# EAGLE design Harp Motor device H2-module v1.0 (EAGLE 9.6.2)
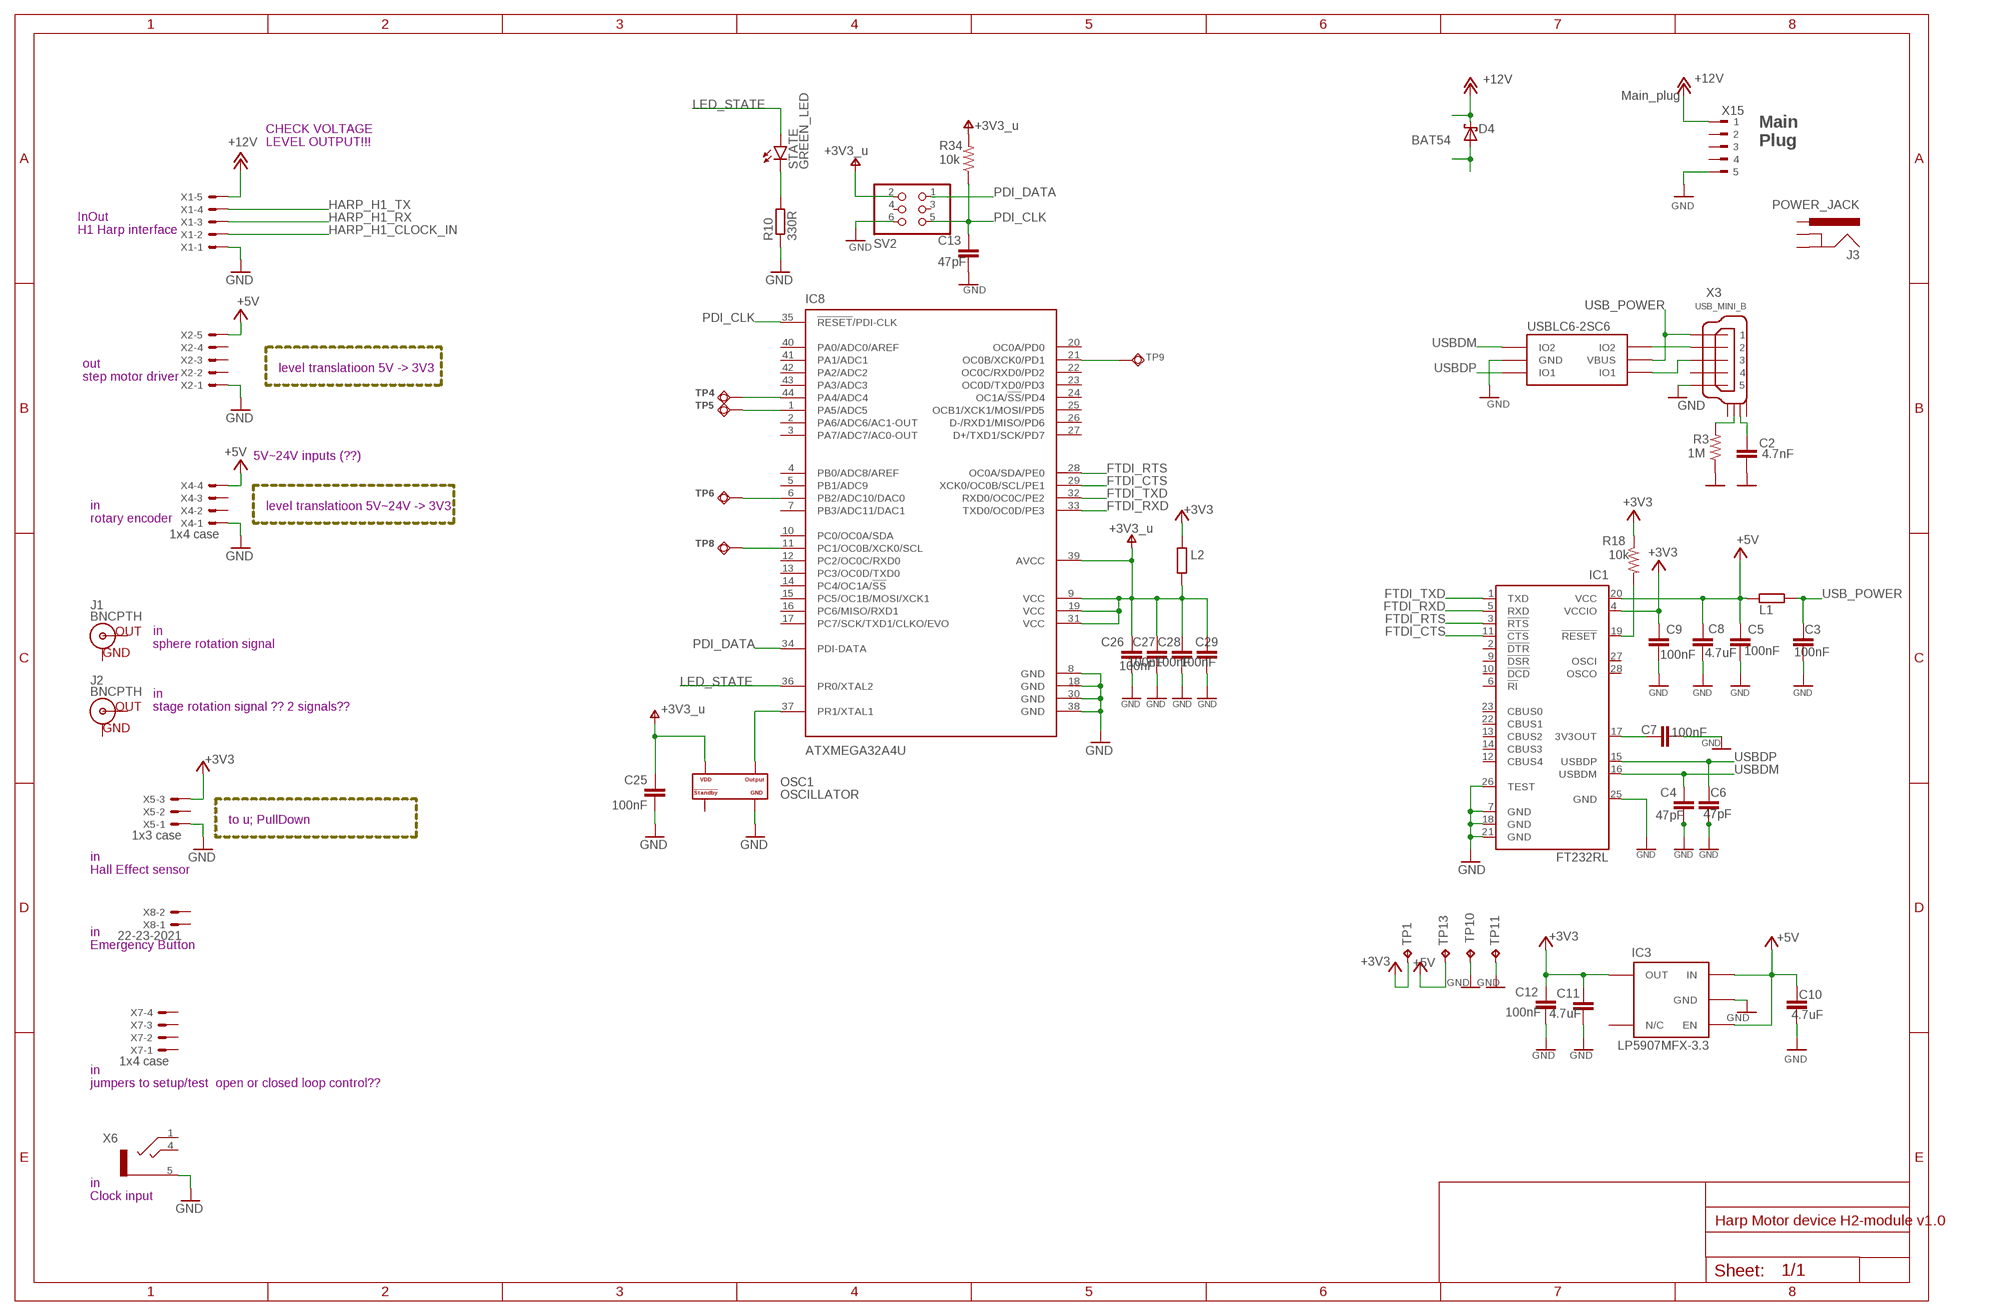
[diagram p0: schematic, sheet 1]

## Parts
C2  4.7nF  C-EUC0402K  [C0402K]
C3  100nF  C-EUC0402K  [C0402K]
C4  47pF  C-EUC0402K  [C0402K]
C5  100nF  C-EUC0402K  [C0402K]
C6  47pF  C-EUC0402K  [C0402K]
C7  100nF  C-EUC0402K  [C0402K]
C8  4.7uF  C-EUC0603  [C0603]
C9  100nF  C-EUC0402K  [C0402K]
C10  4.7uF  C-EUC0603K  [C0603K]
C11  4.7uF  C-EUC0603K  [C0603K]
C12  100nF  C-EUC0402K  [C0402K]
C13  47pF  C-EUC0402K  [C0402K]
C25  100nF  C-EUC0402K  [C0402K]
C26  100nF  C-EUC0402K  [C0402K]
C27  100nF  C-EUC0402K  [C0402K]
C28  100nF  C-EUC0402K  [C0402K]
C29  100nF  C-EUC0402K  [C0402K]
D4  BAT54  [SOT23]
IC1  FT232RL  [SSOP28]
IC3  LP5907MFX-3.3  TLV700XX  [TSOT23-5]
IC7  USBLC6-2SC6  [SOT23-6L]
IC8  ATXMEGA32A4U  XMEGA-A4_AT-XMEGA-XXA4-AUTQFP44  [TQFP44]
J1  BNCPTH  [BNC]
J2  BNCPTH  [BNC]
J3  POWER_JACK  [POWER_JACK_PTH]
L1  40R@100MHz  R-EU_R0603  [R0603]
L2  40R@100MHz  R-EU_R0603  [R0603]
OSC1  OSCILLATOR  [OSCILLATOR_3.2X2.5]
R3  1M  R-US_R0402  [R0402@1]
R10  330R  R-EU_R0402  [R0402]
R18  10k  R-US_R0402  [R0402@1]
R34  10k  R-US_R0402  [R0402@1]
STATE  GREEN_LED  LEDCHIP-LED0603  [CHIP-LED0603]
SV2  PINHD-2X3  [2X03]
TP1  NO_COMPONENT  TPB1,27  [B1,27]
TP4  NO_COMPONENT  TPSQTP11R  [TP11R]
TP5  NO_COMPONENT  TPSQTP11R  [TP11R]
TP6  NO_COMPONENT  TPSQTP11R  [TP11R]
TP8  NO_COMPONENT  TPSQTP11R  [TP11R]
TP9  NO_COMPONENT  TPSQTP11R  [TP11R]
TP10  NO_COMPONENT  TPB1,27  [B1,27]
TP11  NO_COMPONENT  TPB1,27  [B1,27]
TP13  NO_COMPONENT  TPB1,27  [B1,27]
X1  22-23-2051  [22-23-2051]
X2  22-23-2051  [22-23-2051]
X3  USB_MINI_B  [240-0002-1]
X4  1x4 case  22-23-2041  [22-23-2041]
X5  1x3 case  22-23-2031  [22-23-2031]
X6  CLCK_JACK  STEREO_JACK  [35RASMT2BHNTRX]
X7  1x4 case  22-23-2041  [22-23-2041]
X8  22-23-2021  [22-23-2021]
X15  Main_plug  90G-5  [90G-5]

## Nets
+3V3: C9.1 C11.1 C12.1 IC1.4(VCCIO) IC3.5(OUT) L2.2 R18.1 TP1.TP X5.3
+3V3_U: C25.1 C26.1 C27.1 C28.1 C29.1 IC8.9(VCC) IC8.19(VCC) IC8.31(VCC) IC8.39(AVCC) L2.1 OSC1.P$4(VDD) R34.2 SV2.2 ; supply symbol labelled +3V3_u
+5V: C5.1 C8.1 C10.1 IC1.20(VCC) IC3.1(IN) IC3.3(EN) L1.1 TP13.TP
+12V: D4.3(C) X15.1
FTDI_CTS: IC1.11(!CTS) IC8.29(XCK0/OC0B/SCL/PE1)
FTDI_RTS: IC1.3(!RTS) IC8.28(OC0A/SDA/PE0)
FTDI_RXD: IC1.5(RXD) IC8.33(TXD0/OC0D/PE3)
FTDI_TXD: IC1.1(TXD) IC8.32(RXD0/OC0C/PE2)
GND: C2.2 C3.2 C4.2 C5.2 C6.2 C7.2 C8.2 C9.2 C10.2 C11.2 C12.2 C13.2 C25.2 C26.2 C27.2 C28.2 C29.2 IC1.7(GND) IC1.18(GND) IC1.21(GND) IC1.25(GND) IC1.26(TEST) IC3.2(GND) IC7.P$2(GND) IC8.8(GND) IC8.18(GND) IC8.30(GND) IC8.38(GND) OSC1.P$2(GND) R3.1 R10.1 SV2.6 TP10.TP TP11.TP X1.1 X2.1 X3.P$5 X4.1 X5.1 X6.5 X15.5
HARP_H1_CLOCK_IN: X1.2
HARP_H1_RX: X1.3
HARP_H1_TX: X1.4
LED_STATE: IC8.36(PR0/XTAL2) STATE.A
N$1: R3.2 X3.SHIELD_2
N$2: IC7.P$4(IO2) X3.P$2
N$3: IC7.P$6(IO1) X3.P$3
N$4: X1.5 X2.5 X4.4 ; supply symbol labelled +5V, +12V
N$6: D4.1(A)
N$9: R10.2 STATE.C
N$11: IC8.44(PA4/ADC4) TP4.TP
N$12: IC8.1(PA5/ADC5) TP5.TP
N$13: IC8.6(PB2/ADC10/DAC0) TP6.TP
N$15: C2.1 X3.SHIELD_3
N$17: IC8.11(PC1/OC0B/XCK0/SCL) TP8.TP
N$18: IC8.21(OC0B/XCK0/PD1) TP9.TP
N$38: C7.1 IC1.17(3V3OUT)
N$175: IC1.19(!RESET) R18.2
OSC2: IC8.37(PR1/XTAL1) OSC1.P$3(OUTPUT)
PDI_CLK: C13.1 IC8.35(!RESET!/PDI-CLK) R34.1 SV2.5
PDI_DATA: IC8.34(PDI-DATA) SV2.1
USB_POWER: C3.1 IC7.P$5(VBUS) L1.2 X3.P$1
USBDM: C4.1 IC1.16(USBDM) IC7.P$3(IO2)
USBDP: C6.1 IC1.15(USBDP) IC7.P$1(IO1)
Unconnected: IC1.2(!DTR) IC1.6(!RI) IC1.9(!DSR) IC1.10(!DCD) IC1.12(CBUS4) IC1.13(CBUS2) IC1.14(CBUS3) IC1.22(CBUS1) IC1.23(CBUS0) IC1.27(OSCI) IC1.28(OSCO) IC3.4(N/C) IC8.2(PA6/ADC6/AC1-OUT) IC8.3(PA7/ADC7/AC0-OUT) IC8.4(PB0/ADC8/AREF) IC8.5(PB1/ADC9) IC8.7(PB3/ADC11/DAC1) IC8.10(PC0/OC0A/SDA) IC8.12(PC2/OC0C/RXD0) IC8.13(PC3/OC0D/TXD0) IC8.14(PC4/OC1A/!SS) IC8.15(PC5/OC1B/MOSI/XCK1) IC8.16(PC6/MISO/RXD1) IC8.17(PC7/SCK/TXD1/CLKO/EVO) IC8.20(OC0A/PD0) IC8.22(OC0C/RXD0/PD2) IC8.23(OC0D/TXD0/PD3) IC8.24(OC1A/!SS!/PD4) IC8.25(OCB1/XCK1/MOSI/PD5) IC8.26(D-/RXD1/MISO/PD6) IC8.27(D+/TXD1/SCK/PD7) IC8.40(PA0/ADC0/AREF) IC8.41(PA1/ADC1) IC8.42(PA2/ADC2) IC8.43(PA3/ADC3) J1.GND J1.S(OUT) J2.GND J2.S(OUT) J3.GND J3.GNDBREAK J3.PWR OSC1.P$1(STANDBY#) SV2.3 SV2.4 X2.2 X2.3 X2.4 X3.P$4 X3.SHIELD_1 X3.SHIELD_4 X4.2 X4.3 X5.2 X6.1 X6.4 X7.1 X7.2 X7.3 X7.4 X8.1 X8.2 X15.2 X15.3 X15.4

## Notes on the sheet
- CHECK VOLTAGE 
  LEVEL OUTPUT!!!
- Main 
  Plug
- InOut
  H1 Harp interface
- level translatioon 5V -> 3V3
- out
  step motor driver
- 5V~24V inputs (??)
- level translatioon 5V~24V -> 3V3
- in
  rotary encoder
- in
  sphere rotation signal
- in
  stage rotation signal ?? 2 signals??
- to u; PullDown
- in
  Hall Effect sensor
- in
  Emergency Button
- in
  jumpers to setup/test  open or closed loop control??
- in
  Clock input

## Library data of the parts
C2 = rcl:C-EU: CAPACITOR, European symbol; MPN: CC0402KRX7R8BB472; OEPS: OEPS010001
C3 C5 C7 C9 C12 C25-C29 = rcl:C-EU: CAPACITOR, European symbol; DIGIKEY_PN: 445-5932-1-ND; MPN: C1005X7R1H104K050BB; NOTES: -; OEPS: OEPS010004; TYPE: SMD
C4 C6 C13 = rcl:C-EU: CAPACITOR, European symbol; MPN: 04025A470JAT2A; OEPS: OEPS080013
C8 = rcl:C-EU: CAPACITOR, European symbol; MPN: C1608X6S1C475K080AC; OEPS: OEPS010018
C10 C11 = rcl:C-EU: CAPACITOR, European symbol; MPN: C1608X6S1C475K080AC; NOTES: -; OEPS: OEPS010018; TYPE: SMD
D4 = diode:BAT54: Schottky Diodes Source: Fairchild .. BAT54.pdf; MPN: BAT54SLT1G; OEPS: OEPS030003
IC1 = VestibularVR H1-module v1.0:FT232R: UART/FIFO IC; MPN: FT232RL; OEPS: OEPS080013
IC3 = VestibularVR H1-module v1.0:TLV700XX: C REG LINEAR 3.3V 200MA SOT23-5; MPN: LP5907MFX-3.3/NOPB; NOTES: -; OEPS: OEPS080016; TYPE: SMD
IC7 = VestibularVR H1-module v1.0:USBLC6-2SC6: TVS DIODE 5.25VWM 17VC SOT23-6; MPN: USBLC6-2SC6; OEPS: OEPS030010
IC8 = VestibularVR H1-module v1.0:XMEGA-A4_AT-XMEGA-XXA4-AU: ATxMega a4 Serie; DIGIKEY_PN: ATXMEGA32A4U-AURCT-ND; MOUSER_PN: 556-ATXMEGA32A4U-AU; MPN: ATXMEGA32A4U-AUR; OEPS: OEPS080012
J1 J2 = SparkFun-Connectors:BNC: BNC Right Angle Connector Mouser Part# 5227161 SparkFun Products: BNC Connector - Right Angle <https://www.sparkfun.com/products/10550>; PROD_ID: LPA-12729; SF_ID: PRT-10550
J3 = SparkFun-Connectors:POWER_JACK: Power Jack Connector This is the standard 5.5mm barrel jack for power. The PTH is the most common, proven, reliable, footprint. The Slot footprint only works if the mill layer is transmitted to the PCB fab house so be warned. Here are the connectors we sell at SparkFun: DC Barrel Power Jack/Connector <https://www.sparkfun.com/products/119> (PRT-00119) DC Barrel Power Jack/Connector (SMD) <https://www.sparkfun.com/products/12748> (PRT-12748) DC Barrel Jack Adapter - Breadboard Compatible <https://www.sparkfun.com/products/10811> (PRT-10811) It is used on this SparkFun product (and many, many others): SparkFun RedBoard - Programmed with Arduino <https://www.sparkfun.com/products/12757> (DEV-12757) Also, if you need a mating power supply or connector, please check these out: Wall Adapter Power Supply - 9VDC 650mA <https://www.sparkfun.com/products/298> (TOL-00298) DC Barrel Jack Adapter - Male <https://www.sparkfun.com/products/10287> (PRT-10287); PROD_ID: CONN-08197
L1 L2 = rcl:R-EU_: RESISTOR, European symbol; MPN: MI0805K400R-10; OEPS: OEPS040003; SPICEPREFIX: R
OSC1 = VestibularVR H1-module v1.0:OSCILLATOR: XTAL OSC TCXO 32.0000MHZ HCMOS; MPN: DSC1001CI5-032.0000; OEPS: OEPS080018
R3 = rcl:R-US_: RESISTOR, American symbol; DIGIKEY_PN: 541-1.00MLCT-ND; MPN: CRCW04021M00FKED; OEPS: OEPS020026
R10 = rcl:R-EU_: RESISTOR, European symbol; MPN: RC0402FR-07330RL; OEPS: OEPS020037; SPICEPREFIX: R
R18 R34 = rcl:R-US_: RESISTOR, American symbol; DIGIKEY_PN: 541-3959-1-ND; MPN: CRCW040210K0FKED; OEPS: OEPS020030
STATE = led:LED: LED OSRAM: - CHIPLED LG R971, LG N971, LY N971, LG Q971, LY Q971, LO R971, LY R971 LH N974, LH R974 LS Q976, LO Q976, LY Q976 LO Q996 - Hyper CHIPLED LW Q18S LB Q993, LB Q99A, LB R99A - SideLED LS A670, LO A670, LY A670, LG A670, LP A670 LB A673, LV A673, LT A673, LW A673 LH A674 LY A675 LS A676, LA A676, LO A676, LY A676, LW A676 LS A679, LY A679, LG A679 - Hyper Micro SIDELED® LS Y876, LA Y876, LO Y876, LY Y876 LT Y87S - SmartLED LW L88C, LW L88S LB L89C, LB L89S, LG L890 LS L89K, LO L89K, LY L89K LS L896, LA L896, LO L896, LY L896 - TOPLED LS T670, LO T670, LY T670, LG T670, LP T670 LSG T670, LSP T670, LSY T670, LOP T670, LYG T670 LG T671, LOG T671, LSG T671 LB T673, LV T673, LT T673, LW T673 LH T674 LS T676, LA T676, LO T676, LY T676, LB T676, LH T676, LSB T676, LW T676 LB T67C, LV T67C, LT T67C, LS T67K, LO T67K, LY T67K, LW E67C LS E67B, LA E67B, LO E67B, LY E67B, LB E67C, LV E67C, LT E67C LW T67C LS T679, LY T679, LG T679 LS T770, LO T770, LY T770, LG T770, LP T770 LB T773, LV T773, LT T773, LW T773 LH T774 LS E675, LA E675, LY E675, LS T675 LS T776, LA T776, LO T776, LY T776, LB T776 LHGB T686 LT T68C, LB T68C - Hyper Mini TOPLED® LB M676 - Mini TOPLED Santana® LG M470 LS M47K, LO M47K, LY M47K Source: http://www.osram.convergy.de LUXEON: - LUMILED® LXK2-PW12-R00, LXK2-PW12-S00, LXK2-PW14-U00, LXK2-PW14-V00 LXK2-PM12-R00, LXK2-PM12-S00, LXK2-PM14-U00 LXK2-PE12-Q00, LXK2-PE12-R00, LXK2-PE12-S00, LXK2-PE14-T00, LXK2-PE14-U00 LXK2-PB12-K00, LXK2-PB12-L00, LXK2-PB12-M00, LXK2-PB14-N00, LXK2-PB14-P00, LXK2-PB14-Q00 LXK2-PR12-L00, LXK2-PR12-M00, LXK2-PR14-Q00, LXK2-PR14-R00 LXK2-PD12-Q00, LXK2-PD12-R00, LXK2-PD12-S00 LXK2-PH12-R00, LXK2-PH12-S00 LXK2-PL12-P00, LXK2-PL12-Q00, LXK2-PL12-R00 Source: www.luxeon.com KINGBRIGHT: KA-3528ASYC Source: www.kingbright.com; MPN: LTST-C191KGKT; OEPS: OEPS030005
SV2 = Connector:PINHD-2X3: PIN HEADER; CATEGORY: CONNECTOR; MPN: 609-3210-ND; OEPS: OEPS070015; SUB-CATEGORY: PIN-HEADER
TP1 TP10 TP11 TP13 = testpad:TP: Test pad
TP4-TP6 TP8 TP9 = testpad:TPSQ: Test pad
X1 X2 = con-molex:22-23-2051: .100" (2.54mm) Center Header - 5 Pin; MF: MOLEX; MPN: 22-23-2051; OC_FARNELL: 1462952; OC_NEWARK: 38C9178
X3 = VestibularVR H1-module v1.0:USB_MINI_B: CONN RCPT USB2.0 MINI B SMD R/A; MPN: UX60-MB-5S8; OEPS: OEPS070021
X4 X7 = con-molex:22-23-2041: .100" (2.54mm) Center Header - 4 Pin; MF: -; MPN: 282834-4 Digikey A98335-ND; OC_FARNELL: 1462920; OC_NEWARK: 38C0355; OEPS: OEPS07 xxx1
X5 = con-molex:22-23-2031: .100" (2.54mm) Center Header - 3 Pin; MF: -; MPN: 282834-3 Digikey A98334-ND; OC_FARNELL: 1462950; OC_NEWARK: 30C0862; OEPS: OEPS07 xxx2
X6 = harp input expander:STEREO_JACK: CONN JACK STEREO 3.5MM SMD R/A; MPN: 35RASMT2BHNTRX; NOTES: -; TYPE: SMD
X8 = con-molex:22-23-2021: .100" (2.54mm) Center Header - 2 Pin; MF: MOLEX; MPN: 22-23-2021; OC_FARNELL: 1462926; OC_NEWARK: 25C3832
X15 = con-weidmueller-sl35:90G-5: WEIDMUELLER CLAMP CONNECTOR; MPN: 20.155MH/5-E; OC_FARNELL: unknown; OC_NEWARK: unknown; OEPS: OEPS07 xxx3

## Net classes
0 default: clearance 0.205 mm

## Board
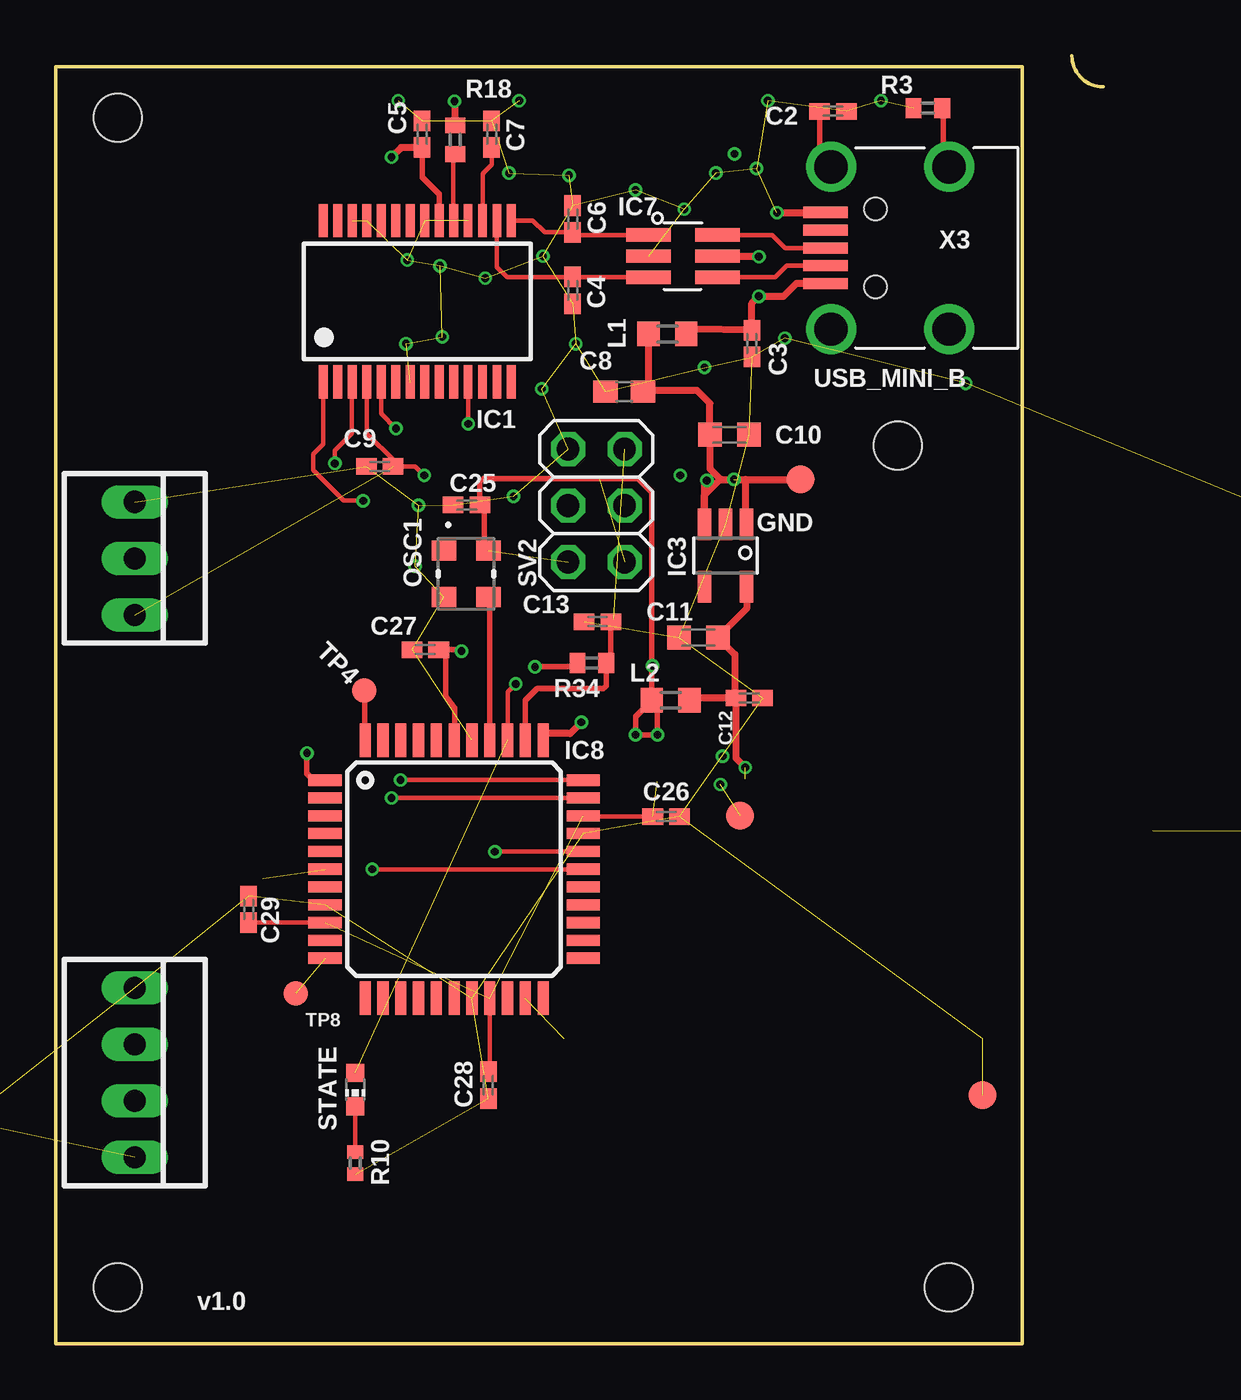
[diagram p1: board, top side]
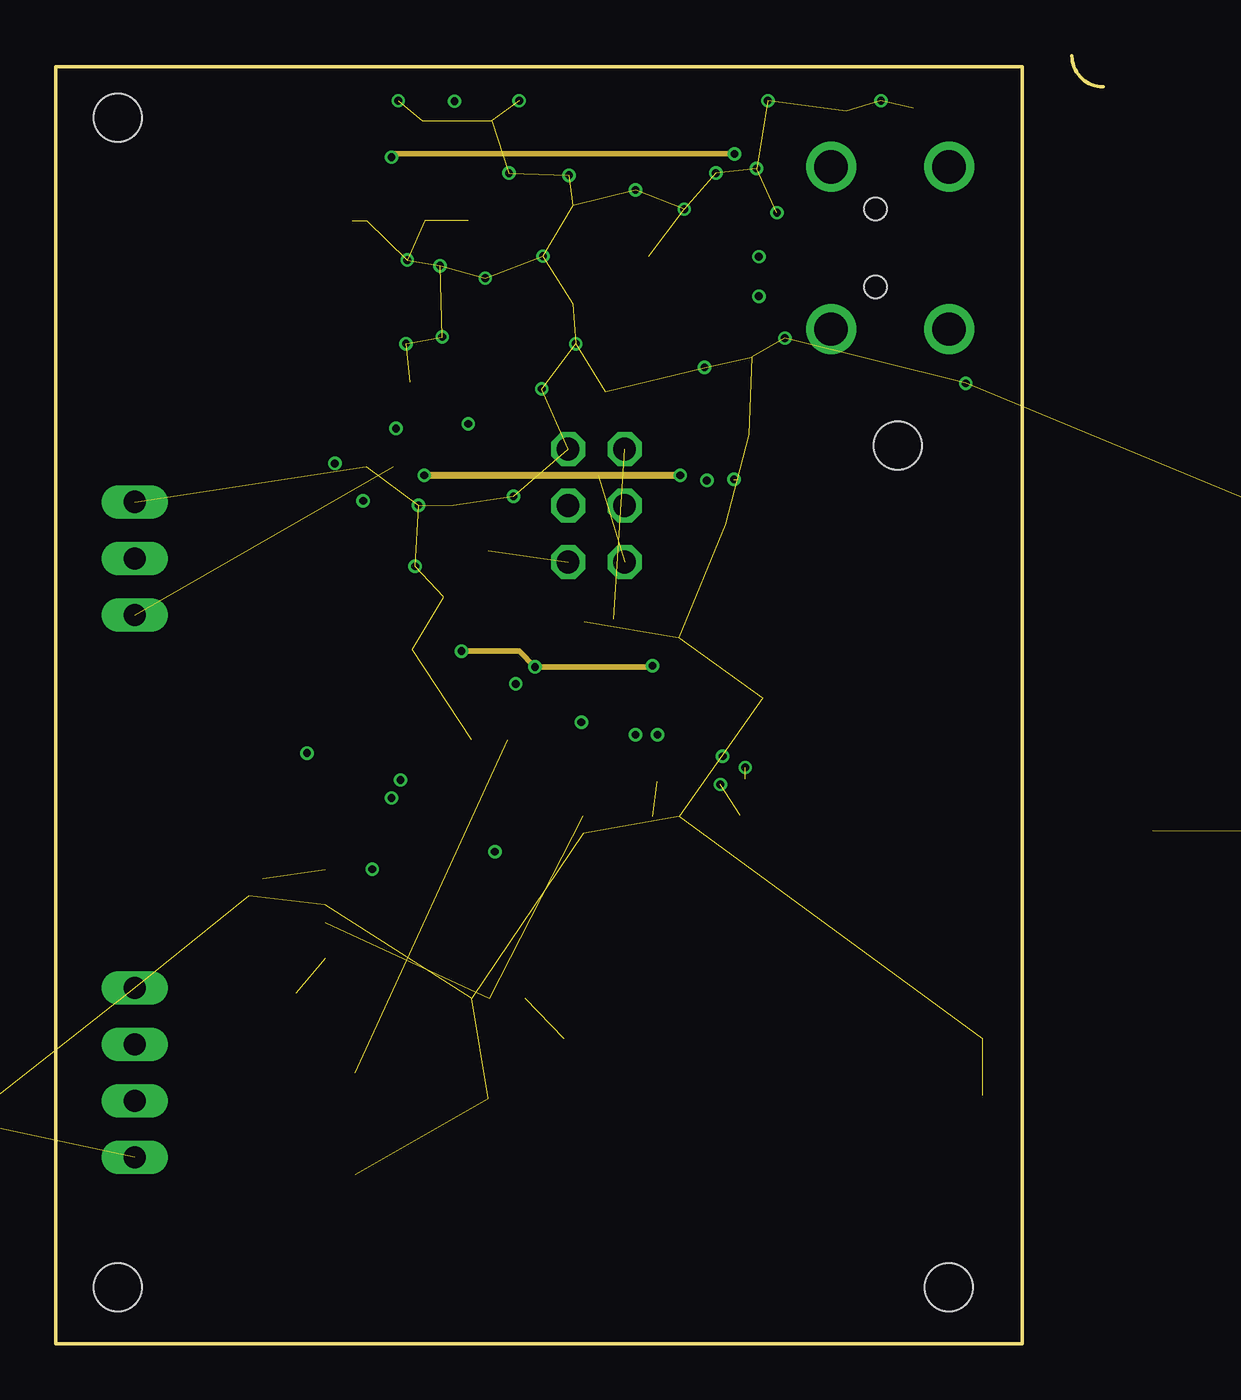
[diagram p2: board, inner layer Route2]
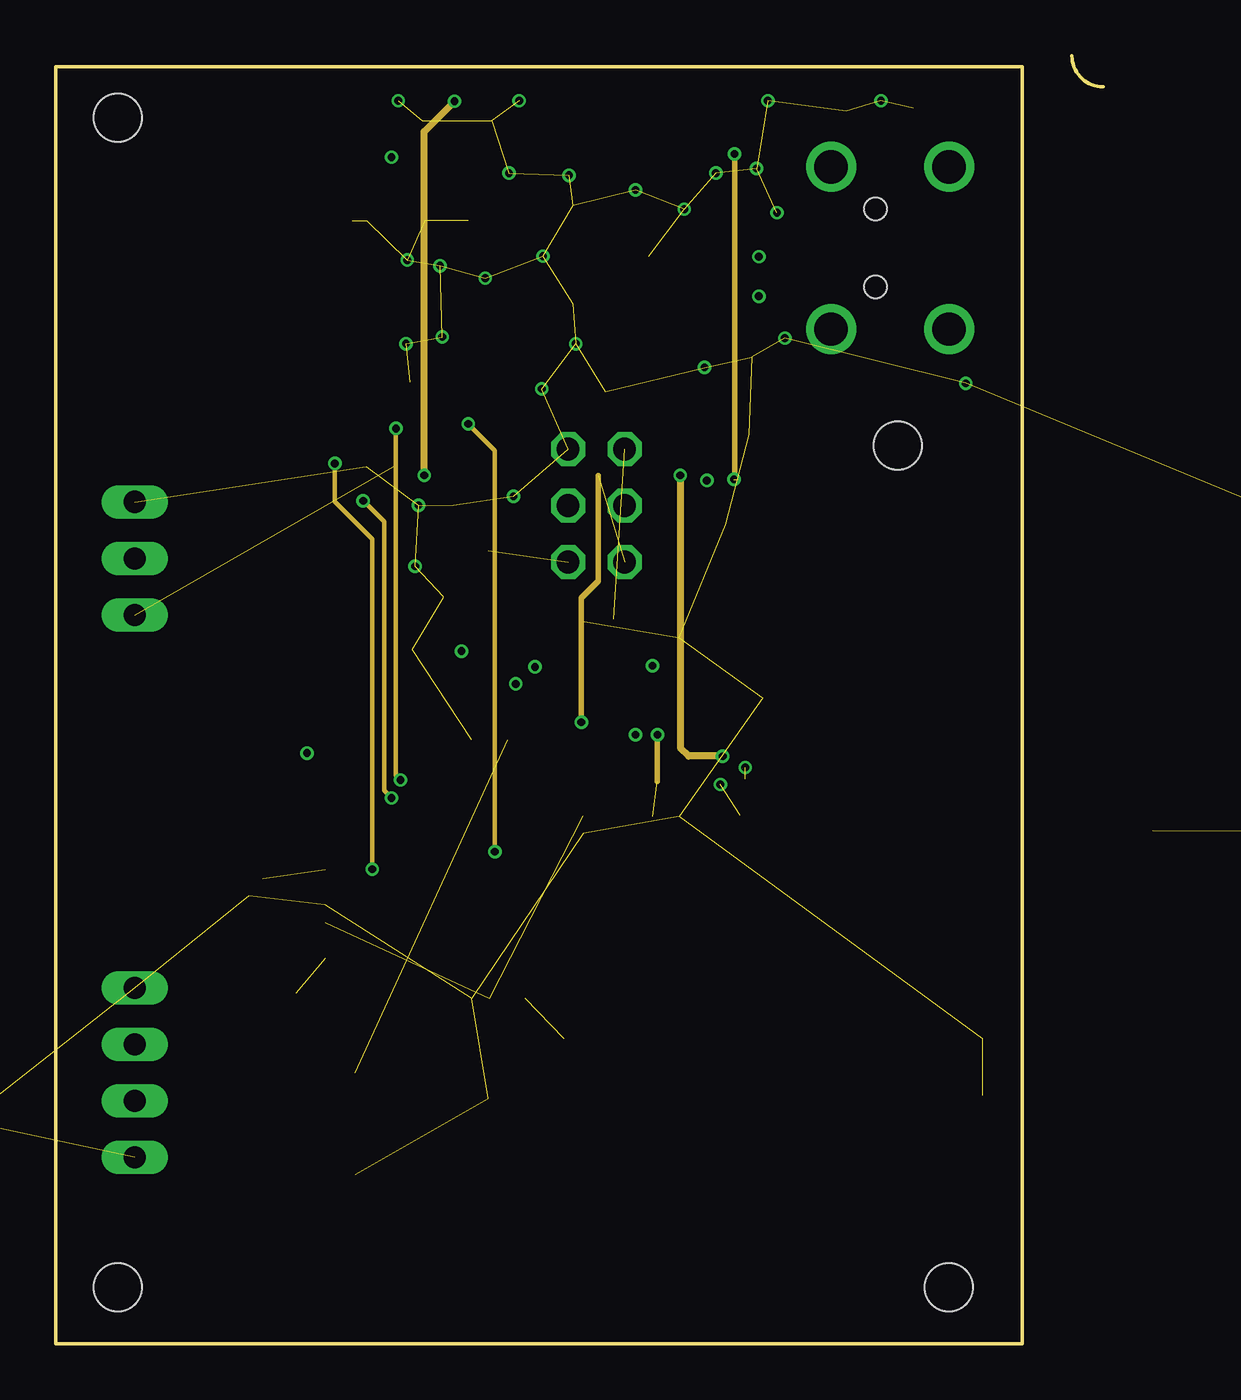
[diagram p3: board, inner layer Route15]
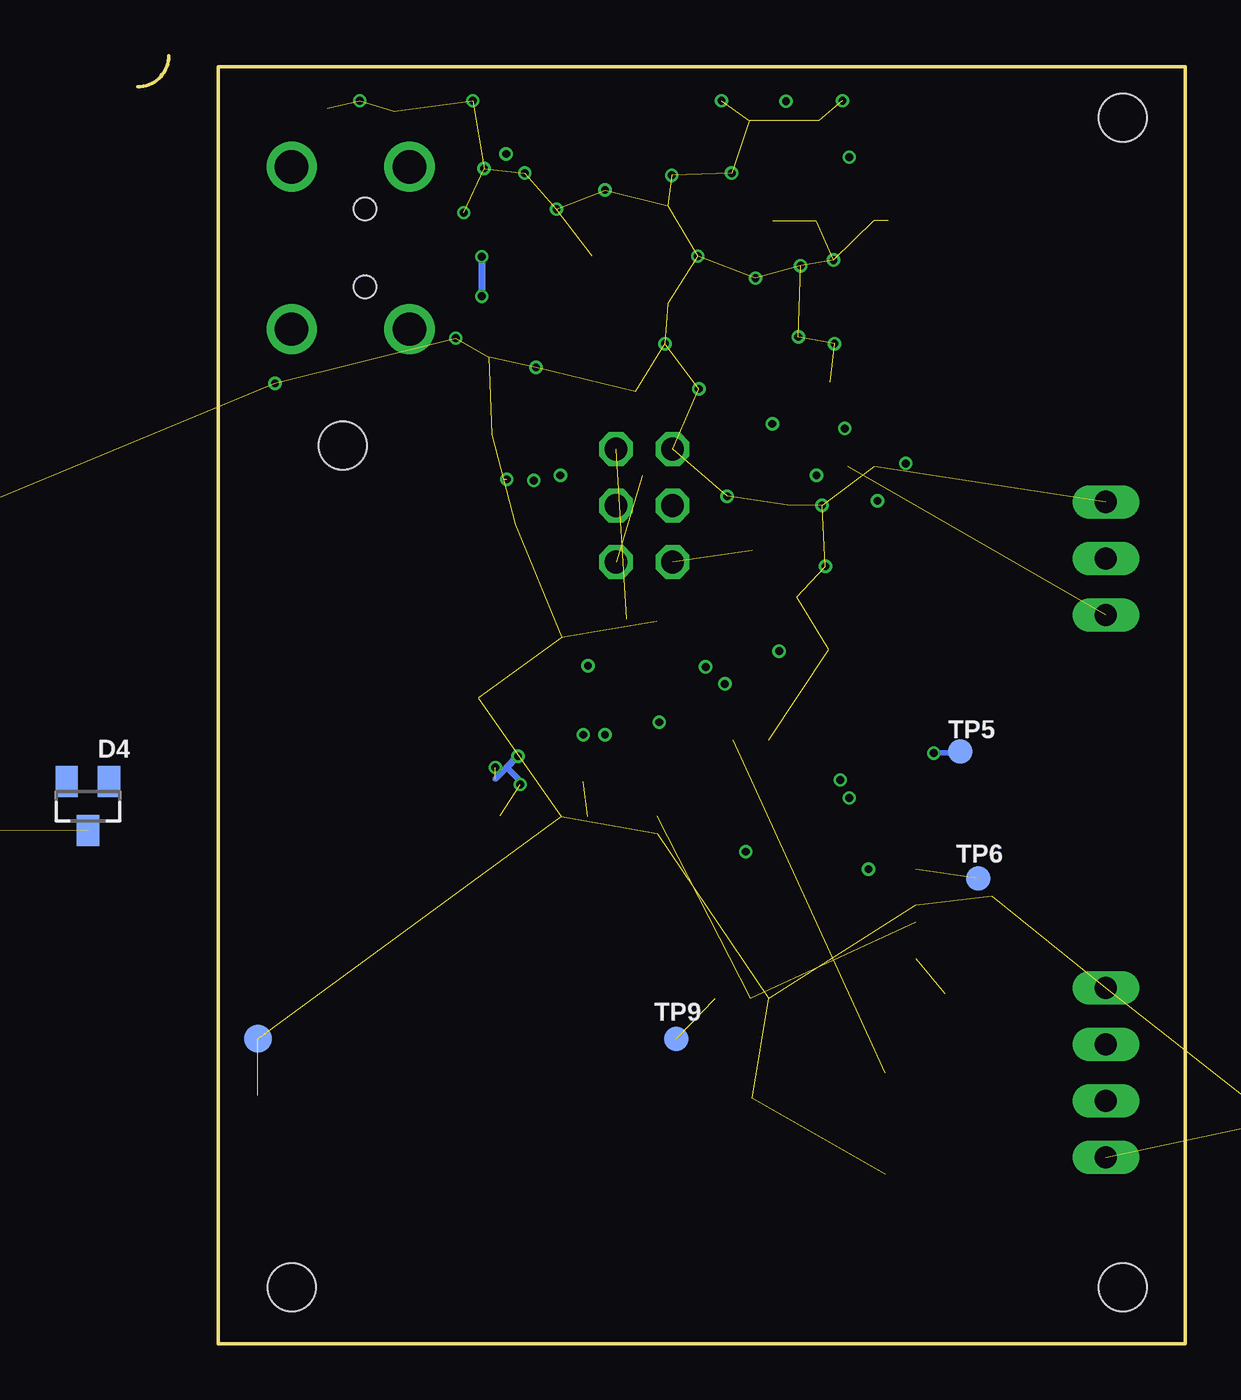
[diagram p4: board, bottom side, seen from below]

Size 47.06 x 57.91 mm. Coordinates in mm from the lower left corner, seen from the top.
Outline: 47.06,56.51 arc-90 45.66,57.91
Outline: 43.43,57.4 0,57.4 0,0 43.43,0 43.43,57.4
Copper layers (1+2*15+16): Top 0.018mm / dielectric 0.36mm / Route2 0.035mm / dielectric 0.71mm / Route15 0.035mm / dielectric 0.2mm / Bottom 0.018mm
Design rules "my design rules": minimum track width 0.15mm, minimum drill 0.35mm, track to track 6mil, track to pad 6mil, pad to pad 6mil, via to via 6mil, smd to smd 6mil, copper to edge 0.25mm, drill to drill 0.35mm, minimum pad ring 0.175mm, minimum via ring 0.125mm, stop-mask expansion 0mil, vias tented up to drill 0.45mm, thermal gap 0.2mm
Holes 2.15 mm at 2.79,2.54 2.79,55.12 40.13,2.54 37.85,40.39

### Footprints (pad centres in the part's own frame; a part is rotated, then mirrored left to right if it is on the bottom)
C0402K = smd 0.925 x 0.74: 1 -0.6,0; 2 0.6,0
C0603 = smd 1.1 x 1: 1 -0.85,0; 2 0.85,0
C0603K = smd 1.05 x 1.08: 1 -0.875,0; 2 0.875,0
SOT23 = smd 1 x 1.4: 1 -0.95,-1.1; 2 0.95,-1.1; 3 0,1.1
SSOP28 = smd 0.4 x 1.5: 1 -4.225,-3.625; 2 -3.575,-3.625; 3 -2.925,-3.625; 4 -2.275,-3.625; 5 -1.625,-3.625; 6 -0.975,-3.625; 7 -0.325,-3.625; 8 0.325,-3.625; 9 0.975,-3.625; 10 1.625,-3.625; 11 2.275,-3.625; 12 2.925,-3.625; 13 3.575,-3.625; 14 4.225,-3.625; 15 4.225,3.625; 16 3.575,3.625; 17 2.925,3.625; 18 2.275,3.625; 19 1.625,3.625; 20 0.975,3.625; 21 0.325,3.625; 22 -0.325,3.625; 23 -0.975,3.625; 24 -1.625,3.625; 25 -2.275,3.625; 26 -2.925,3.625; 27 -3.575,3.625; 28 -4.225,3.625
TSOT23-5 = smd 0.6 x 1.408: 1 -0.95,-1.404; 2 0,-1.404; 3 0.95,-1.404; 4 0.95,1.404; 5 -0.95,1.404
SOT23-6L = smd 0.6 x 2: P$1 -0.95,-1.55; P$2 0,-1.55; P$3 0.95,-1.55; P$4 0.95,1.55; P$5 0,1.55; P$6 -0.95,1.55
TQFP44 = smd 1.5 x 0.5: 1 -5.8,4; 2 -5.8,3.2; 3 -5.8,2.4; 4 -5.8,1.6; 5 -5.8,0.8; 6 -5.8,0; 7 -5.8,-0.8; 8 -5.8,-1.6; 9 -5.8,-2.4; 10 -5.8,-3.2; 11 -5.8,-4; 23 5.8,-4; 24 5.8,-3.2; 25 5.8,-2.4; 26 5.8,-1.6; 27 5.8,-0.8; 28 5.8,0; 29 5.8,0.8; 30 5.8,1.6; 31 5.8,2.4; 32 5.8,3.2; 33 5.8,4 | smd 0.5 x 1.5: 12 -4,-5.8; 13 -3.2,-5.8; 14 -2.4,-5.8; 15 -1.6,-5.8; 16 -0.8,-5.8; 17 0,-5.8; 18 0.8,-5.8; 19 1.6,-5.8; 20 2.4,-5.8; 21 3.2,-5.8; 22 4,-5.8; 34 4,5.8; 35 3.2,5.8; 36 2.4,5.8; 37 1.6,5.8; 38 0.8,5.8; 39 0,5.8; 40 -0.8,5.8; 41 -1.6,5.8; 42 -2.4,5.8; 43 -3.2,5.8; 44 -4,5.8
BNC = drill 2.2: 3 -5.08,5.08; 4 5.08,5.08 | drill 0.8 long: GND -2.54,0; S 0,0
POWER_JACK_PTH = drill 2.997 pad 4.318: GND 0,7.7; GNDBREAK 4.7,10.7; PWR 0,13.7
R0603 = smd 1 x 1.1: 1 -0.85,0; 2 0.85,0
OSCILLATOR_3.2X2.5 = smd 0.9 x 1.1: P$1 -1.05,-1; P$2 1.05,-1; P$3 1.05,1; P$4 -1.05,1
R0402@1 = smd 0.7 x 0.9: 1 -0.65,0; 2 0.65,0
R0402 = smd 0.6 x 0.7: 1 -0.5,0; 2 0.5,0
CHIP-LED0603 = smd 0.8 x 0.8: A 0,-0.75; C 0,0.75
2X03 = drill 1.016 octagon: 1 -2.54,-1.27; 2 -2.54,1.27; 3 0,-1.27; 4 0,1.27; 5 2.54,-1.27; 6 2.54,1.27
B1,27 = smd 1.27 x 1.27: TP 0,0
TP11R = smd 1.1 x 1.1: TP 0,0
22-23-2051 = drill 1 long: 1 -5.08,0; 2 -2.54,0; 3 0,0; 4 2.54,0; 5 5.08,0
240-0002-1 = smd 0.5 x 2: P$1 -1.6,8.65; P$2 -0.8,8.65; P$3 0,8.65; P$4 0.8,8.65; P$5 1.6,8.65 | drill 1.5: SHIELD_1 -3.65,3.1; SHIELD_2 3.65,3.1; SHIELD_3 3.65,8.4; SHIELD_4 -3.65,8.4 | hole 1: -1.75,6.4; 1.75,6.4
22-23-2041 = drill 1 long: 1 -3.81,0; 2 -1.27,0; 3 1.27,0; 4 3.81,0
22-23-2031 = drill 1 long: 1 -2.54,0; 2 0,0; 3 2.54,0
35RASMT2BHNTRX = smd 2.4 x 2.55: 1 0.8,3.675; 5 -1.1,-3.675 | smd 2.9 x 2.75: 4 8.2,-3.575 | hole 1.6: 0,0; 7,0
22-23-2021 = drill 1 long: 1 -1.27,0; 2 1.27,0
90G-5 = drill 1.422 long: 1 -7,5.25; 2 -3.5,5.25; 3 0,5.25; 4 3.5,5.25; 5 7,5.25

### Placement (x,y rotation side)
C2  34.93,55.41 0 top
C3  31.28,44.96 270 top
C4  23.23,47.35 270 top
C5  16.46,54.37 90 top
C6  23.23,50.56 90 top
C7  19.59,54.37 90 top
C8  25.55,42.8 180 top
C9  14.56,39.44 180 top
C10  30.28,40.87 0 top
C11  28.88,31.75 180 top
C12  31.17,29.03 0 top
C13  24.35,32.46 180 top
C25  18.46,37.71 180 top
C26  27.43,23.7 0 top
C27  16.61,31.21 180 top
C28  19.44,11.63 270 top
C29  8.68,19.53 90 top
D4  49.3,24.18 180 bottom
IC1  16.26,46.86 0 top
IC3  30.1,35.43 180 top
IC7  28.19,48.9 270 top
IC8  17.91,21.34 0 top
J1  -7.37,50.04 90 top  (outside the outline)
J2  -7.62,32.51 90 top  (outside the outline)
J3  69.85,8.89 90 top  (outside the outline)
L1  27.49,45.4 0 top
L2  27.64,28.93 0 top
OSC1  18.44,34.62 270 top
R3  39.19,55.54 0 top
R10  13.46,8.13 90 top
R18  17.97,54.13 270 top
R34  24.09,30.59 180 top
STATE  13.46,11.43 180 top
SV2  24.3,37.68 90 top
TP1  30.76,23.75 0 top
TP4  13.87,29.36 0 top
TP5  10.11,26.62 0 bottom
TP6  9.3,20.93 0 bottom
TP8  10.79,15.75 0 top
TP9  22.86,13.72 0 bottom
TP10  41.66,11.18 0 top
TP11  41.66,13.72 0 bottom
TP13  33.48,38.86 0 top
X1  -39.12,-69.09 0 top  (outside the outline)
X2  -14.22,7.11 90 top  (outside the outline)
X3  43.25,49.26 90 top
X4  3.56,12.19 270 top
X5  3.56,35.31 270 top
X6  -40.13,-58.67 0 top  (outside the outline)
X7  -46.99,-90.93 0 top  (outside the outline)
X8  -49.53,-80.01 0 top  (outside the outline)
X15  60.96,30.05 90 top  (outside the outline)

### Tracks (layer width: path | path; a pad name or v marks a point on that pad's centre or on a via)
+3V3  (via drill 0.35 pad 0.6)  (3 unrouted)
  Top 0.203: IC1.4 13.98,40.92 15.21,39.7 C9.1 16.16,39.44 v16.56,39.04
  Top 0.305: IC3.5 31.05,33.04 C11.1 30.52,30.99 30.52,29.03 C12.1 | C12.1 28.59,29.03 L2.2 | v17.93,55.86 17.97,55.82 R18.1 | C12.1 30.57,26.33 v30.99,25.91
  Route2 0.305: v28.07,39.04 v16.56,39.04
  Route15 0.305: v28.07,39.04 28.07,26.8 28.45,26.42 v29.97,26.42 | v16.56,39.04 16.56,54.49 v17.93,55.86
  Bottom 0.254: 30.99,25.4 30.48,25.91 29.87,25.3 v29.87,25.15
  Bottom 0.305: 30.48,25.91 v29.97,26.42
+3V3_U  (via drill 0.35 pad 0.6)  (4 unrouted)
  Top 0.203: IC8.9 C29.1 | IC8.19 19.51,12.3 C28.1 | C26.1 23.74,23.7 IC8.31
  Top 0.254: OSC1.P$4 19.26,35.85 19.26,37.51 C25.1 19.06,38.73 19.24,38.9 26.19,38.9 26.8,38.29 26.8,30.5 v26.82,30.48 26.79,30.48 26.79,29.03 L2.1 | IC8.39 17.93,27.16 17.93,28.58 17.52,29.11 17.52,30.91 C27.1 17.98,31.21 18.05,31.14 v18.24,31.14 | L2.1 26.06,28.21 v26.06,27.38 v27.04,27.38 27.03,27.4 27.03,28.69 L2.1 | R34.2 23.29,30.44 21.55,30.44 v21.54,30.43
  Route2 0.254: v18.24,31.14 20.83,31.14 v21.54,30.43 26.77,30.43 v26.82,30.48
  Route15 0.254: v26.06,27.38 26.02,27.35 | v27.04,27.38 27.04,25.28
+5V  (via drill 0.35 pad 0.6)  (1 unrouted)
  Top 0.254: IC1.20 17.23,51.69 16.46,52.45 C5.1
  Top 0.305: L1.1 26.64,43.2 C8.1 26.45,42.85 28.83,42.85 29.4,42.28 C10.1 29.4,39.34 29.87,38.87 | 29.87,38.87 29.88,38.86 v30.48,38.86 30.99,38.86 30.99,36.9 IC3.1 | 30.64,38.86 TP13.TP | 29.87,38.87 29.15,38.15 IC3.3 29.15,38.7 v29.26,38.81 | C5.1 15.52,53.77 v15.09,53.34
  Route2 0.254: v30.5,53.49 15.24,53.49 v15.09,53.34
  Route15 0.254: v30.5,53.49 30.5,38.89 v30.48,38.86
  Route15 0.305: v29.26,38.81 29.41,38.81
+12V  (1 unrouted)
FTDI_CTS  (via drill 0.35 pad 0.6)
  Top 0.203: IC1.11 18.54,43.23 v18.54,41.35 | v19.74,22.12 19.75,22.14 IC8.29
  Route15 0.203: v18.54,41.35 19.74,40.16 v19.74,22.12
FTDI_RTS  (via drill 0.35 pad 0.6)
  Top 0.203: IC1.3 13.31,43.22 13.31,40.93 12.55,40.16 v12.55,39.57 | IC8.28 v14.22,21.34
  Route15 0.203: v12.55,39.57 12.55,37.86 14.12,36.28 14.22,36.18 v14.22,21.34
FTDI_RXD  (via drill 0.35 pad 0.6)
  Top 0.203: IC1.5 14.63,41.81 v15.29,41.15 | IC8.33 23.69,25.35 v15.49,25.35
  Route15 0.203: v15.29,41.15 15.29,25.55 v15.49,25.35
FTDI_TXD  (via drill 0.35 pad 0.6)
  Top 0.203: IC1.1 12.03,40.44 11.57,39.99 11.57,39.28 12.95,37.9 v13.82,37.9 | IC8.32 v15.09,24.54 | v15.09,24.54
  Route15 0.203: v13.82,37.9 14.76,36.96 14.76,24.87 v15.09,24.54
GND  (via drill 0.35 pad 0.6)  (64 unrouted)
  Top 0.305: v32.41,50.85 34.59,50.85
  Top 0.508: 34.59,50.85 X3.P$5
  other vias: 20.83,55.88 17.37,45.26 37.08,55.88 26.06,51.87 16.31,37.69 20.57,38.1 40.89,43.18 21.89,48.9 23.37,44.96 21.84,42.93 15.39,55.88 17.27,48.46 19.3,47.9 15.8,48.72 15.75,44.96 20.37,52.63 29.67,52.63 23.06,52.53 28.24,51 32,55.88 31.5,52.83 29.16,43.89 16.15,34.95 32.77,45.21
LED_STATE  (via drill 0.35 pad 0.6)  (1 unrouted)
  Top 0.203: IC8.36 20.31,29.3 v20.68,29.67
  Route15 0.203: v20.68,29.67 20.65,29.64
N$1
  Top 0.254: R3.2 39.89,55.49 39.89,53.16 X3.SHIELD_2
N$2
  Top 0.2: 29.75,47.95 IC7.P$4
  Top 0.203: X3.P$2 32.84,48.46 32.34,47.95 29.75,47.95
N$3
  Top 0.203: IC7.P$6 32.2,49.84 32.78,49.26 X3.P$3
N$4  (2 unrouted)
N$9
  Top 0.203: STATE.C R10.2
N$11
  Top 0.254: TP4.TP 13.89,29.34 13.89,27.15 IC8.44
N$12  (via drill 0.35 pad 0.6)
  Top 0.254: v11.29,26.55 11.29,25.64 11.6,25.34 IC8.1
  Bottom 0.254: v11.29,26.55 10.17,26.55 TP5.TP
N$13  (1 unrouted)
N$15
  Top 0.254: C2.1 34.33,53.42 X3.SHIELD_3
N$17  (1 unrouted)
N$18  (1 unrouted)
N$38
  Top 0.203: IC1.17 19.18,52.6 19.59,53.01 C7.1
N$175
  Top 0.203: 17.86,53.38 17.86,50.5
  Top 0.254: IC1.19 17.86,50.5 | 17.86,53.38 R18.2
OSC2
  Top 0.254: OSC1.P$3 19.51,33.5 IC8.37
PDI_CLK  (1 unrouted)
  Top 0.254: IC8.35 21.11,28.91 21.64,29.45 24.62,29.45 24.74,29.58 R34.1 24.95,30.63 C13.1 25.08,32.59
PDI_DATA  (via drill 0.35 pad 0.6)  (1 unrouted)
  Top 0.305: IC8.34 21.91,27.43 23.11,27.43 v23.62,27.94
  Route15 0.254: 24.38,39.04 24.38,34.29 23.62,33.53 v23.62,27.94
USB_POWER  (via drill 0.35 pad 0.6)
  Top 0.254: 28.65,45.61 L1.2 | 29.77,48.87 IC7.P$5
  Top 0.305: 28.65,45.61 C3.1 31.28,46.78 31.59,47.08 v31.6,47.09 v31.61,47.08 32.71,47.08 33.28,47.66 X3.P$1 | v31.6,48.87 29.77,48.87
  Bottom 0.305: v31.6,48.87 v31.6,47.09
USBDM
  Top 0.203: IC1.16 19.83,48.41 20.28,47.95 C4.1 | C4.1 23.23,47.96 | C4.1 IC7.P$3
USBDP
  Top 0.203: IC1.15 21.45,50.49 21.97,49.96 C6.1 23.35,49.84 IC7.P$1

### Text on the board
tPlace: GND | v1.0
tTest: camm_trigg_1 | camm_trigg_2 | lick_port_1 | lick_port_2 | reward_valve_1 | reward_valve_2 | Optical_flow_1 | Optical_flow_2